# EAGLE design dac8 (EAGLE 6.5.0)
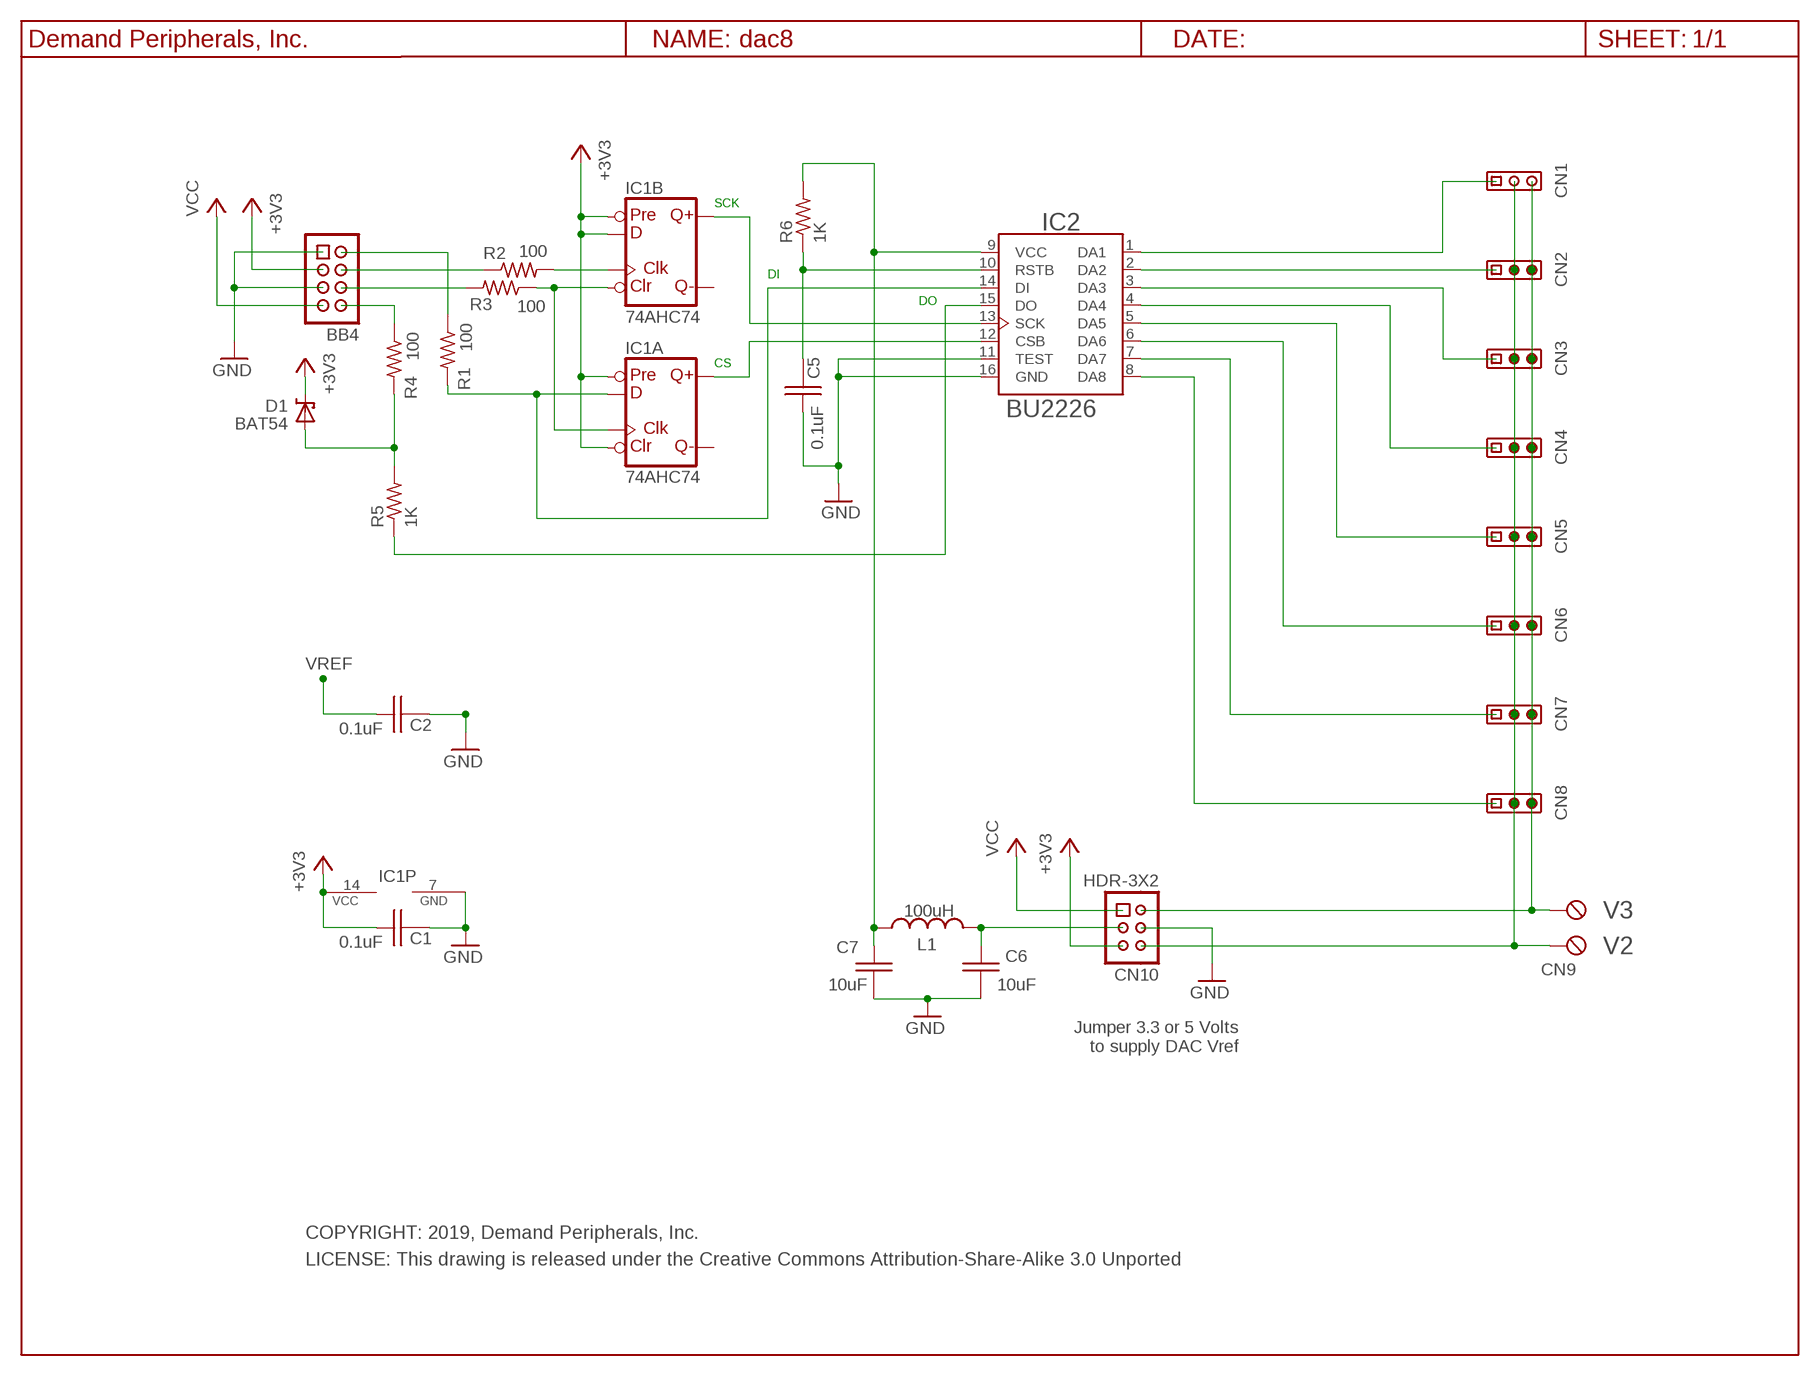
[diagram p0: schematic, sheet 1]

## Parts
BB4  BB4  HDR-4X2-SHR  [HDR-4X2]
C1  0.1uF  C0.1UF_C0603  [C0603]
C2  0.1uF  C0.1UF_C0603  [C0603]
C5  0.1uF  C0.1UF_C0603  [C0603]
C6  10uF  C10UF35V_C0805  [C0805]
C7  10uF  C10UF35V_C0805  [C0805]
CN1  HDR-3X1  [HDR-3X1]
CN2  HDR-3X1  [HDR-3X1]
CN3  HDR-3X1  [HDR-3X1]
CN4  HDR-3X1  [HDR-3X1]
CN5  HDR-3X1  [HDR-3X1]
CN6  HDR-3X1  [HDR-3X1]
CN7  HDR-3X1  [HDR-3X1]
CN8  HDR-3X1  [HDR-3X1]
CN9  TBLK-5.08-X2  [TBLK-5.08-X2]
CN10  HDR-3X2  [HDR-3X2]
D1  BAT54  [SOT23]
IC1  74AHC74  74AHC74SS  [SO14]
IC2  BU2226  [SO16]
L1  100uH  L_100UH_0805  [L0805]
R1  100  R100_R0603  [R0603]
R2  100  R100_R0603  [R0603]
R3  100  R100_R0603  [R0603]
R4  100  R100_R0603  [R0603]
R5  1K  R1K_R0603  [R0603]
R6  1K  R1K_R0603  [R0603]
S1  DP_FRAME_L  [L_FRAME]

## Nets
+3V3: BB4.3 C1.1 CN10.5 D1.3(CC) IC1.1(A:CLR) IC1.4(A:PRE) IC1.10(B:PRE) IC1.12(B:D) IC1.14(P:VCC)
GND: BB4.1 BB4.5 C1.2 C2.2 C5.1 C6.2 C7.2 CN10.4 IC1.7(P:GND) IC2.11(TEST) IC2.16(GND)
N$1: IC1.5(A:Q) IC2.12(CSB)
N$2: IC1.9(B:Q) IC2.13(SCK)
N$3: CN1.1 IC2.1(DA1)
N$4: C5.2 IC2.10(RSTB) R6.1
N$5: C6.1 CN10.3 L1.2
N$6: CN2.1 IC2.2(DA2)
N$7: CN3.1 IC2.3(DA3)
N$9: CN4.1 IC2.4(DA4)
N$10: CN5.1 IC2.5(DA5)
N$11: CN6.1 IC2.6(DA6)
N$12: CN7.1 IC2.7(DA7)
N$13: IC1.3(A:CLK) IC1.13(B:CLR) R3.1
N$14: BB4.4 R2.1
N$15: IC1.2(A:D) IC2.14(DI) R1.2
N$16: IC1.11(B:CLK) R2.2
N$17: CN8.1 IC2.8(DA8)
N$18: D1.1(A) R4.2 R5.2
N$19: BB4.6 R3.2
N$20: BB4.2 R1.1
N$21: BB4.8 R4.1
N$22: IC2.15(DO) R5.1
V2: CN1.2 CN2.2 CN3.2 CN4.2 CN5.2 CN6.2 CN7.2 CN8.2 CN9.1(KL) CN10.6
V3: CN1.3 CN2.3 CN3.3 CN4.3 CN5.3 CN6.3 CN7.3 CN8.3 CN9.2(KL1) CN10.2
VCC: BB4.7 CN10.1
VREF: C2.1 C7.1 IC2.9(VCC) L1.1 R6.2
Unconnected: IC1.6(A:!Q) IC1.8(B:!Q)

## Notes on the sheet
- SCK
- DI
- DO
- CS
- V3
- V2
- Jumper 3.3 or 5 Volts
  to supply DAC Vref
- COPYRIGHT: 2019, Demand Peripherals, Inc.
- LICENSE: This drawing is released under the Creative Commons Attribution-Share-Alike 3.0 Unported

## Library data of the parts
BB4 = dpi-conn:HDR-4X2-SHR: Shrouded 4x2 pin header; VENDOR: Digikey; VENDOR-PART-NUM: 609-3530-ND
C1 C2 C5 = dpi-passive:C0.1UF_: 0.1 uF Capacitor, 25V, X7R; VENDOR: Digikey; VENDOR-PART-NUM: 1276-1126-2-ND
C6 C7 = dpi-passive:C10UF35V_: 10 uF Capacitor, 35V, X6S; VENDOR: Digikey; VENDOR-PART-NUM: 490-10504-2-ND
CN1-CN8 = dpi-conn:HDR-3X1: 3 pin header on 0.1 inch centers, no shroud, no lock; VENDOR: Digikey; VENDOR-PART-NUM: 952-2264-ND
CN9 = dpi-conn:TBLK-5.08-X2: Terminal Block, 5.08mm, x2, screw terminals; VENDOR: Digikey; VENDOR-PART-NUM: ED2609-ND
CN10 = dpi-conn:HDR-3X2: Unshrouded 3x2 header with 0.1 inch pitch; VENDOR: Digikey; VENDOR-PART-NUM: 952-2120-ND
D1 = dpi-diopto:BAT54: Schottky Diode; VENDOR: Digikey; VENDOR-PART-NUM: DB3Y313KELCT-ND
IC1 = dpi-transic:74AHC74: Dual D type positive edge triggered FLIP FLOP, preset and clear; VENDOR: Digikey; VENDOR-PART-NUM: 568-4458-1-ND
IC2 = dpi-transic:BU2226: Rohm octal 8-bit DAC
L1 = dpi-passive:L_100UH_0805: Inductor, 100uH, 140ma; VENDOR: Digikey; VENDOR-PART-NUM: 445-9496-1-ND
R1-R4 = dpi-passive:R100_: 100 Ohm resistor, 1%, 0.1 watt; VENDOR: Digikey; VENDOR-PART-NUM: 311-100HRTR-ND
R5 R6 = dpi-passive:R1K_: 1K Resistor, 1%, 0.1 watt; VENDOR: Digikey; VENDOR-PART-NUM: 311-1.00KHRTR-ND
S1 = dpi-sym:DP_FRAME_L: Landscape Document Frame

## Board
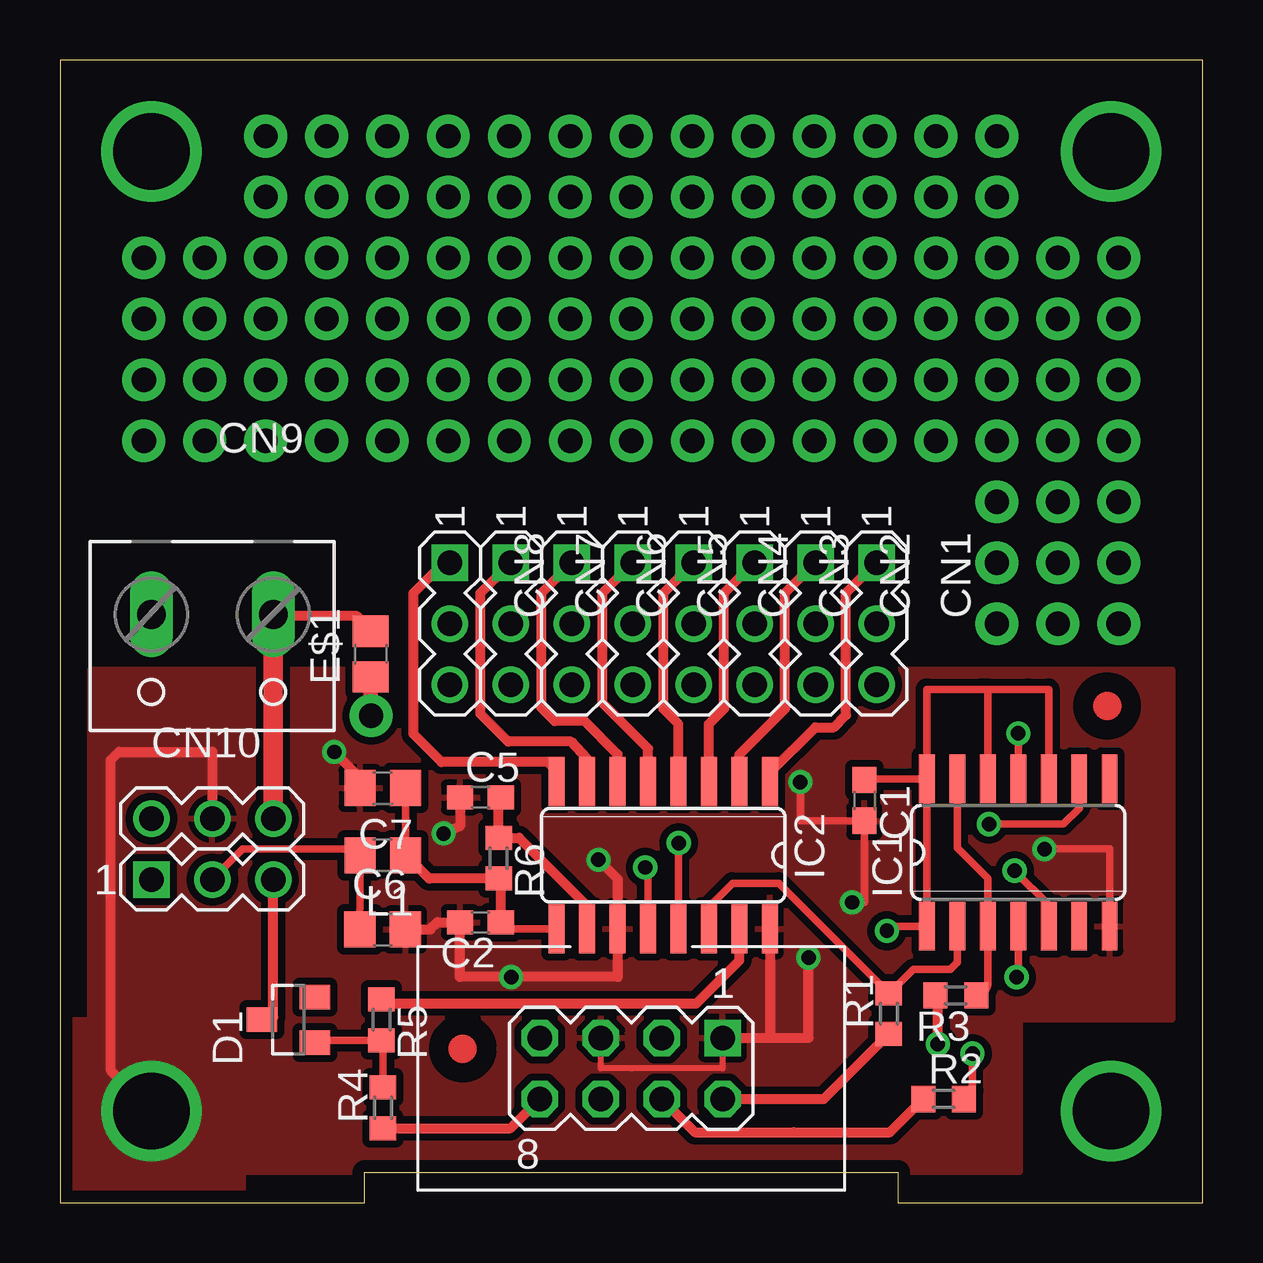
[diagram p1: board, top side]
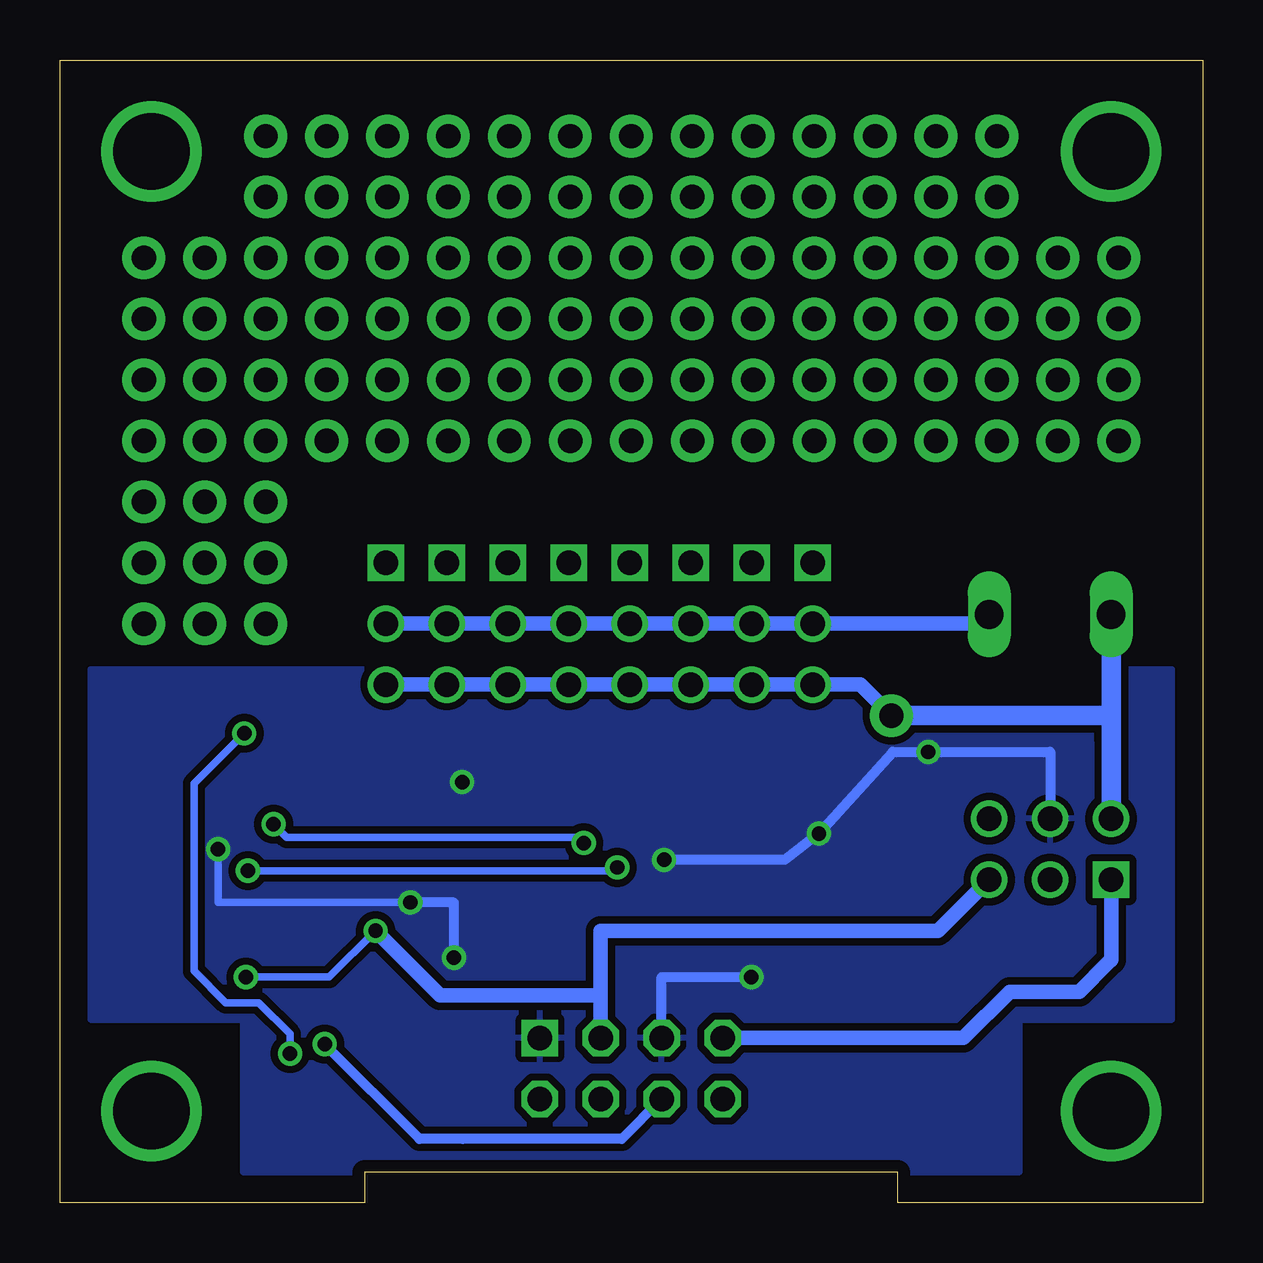
[diagram p2: board, bottom side, seen from below]

Size 47.62 x 47.62 mm. Coordinates in mm from the lower left corner, seen from the top.
Outline: 0,0 12.7,0 12.7,1.27 34.92,1.27 34.92,0 47.62,0 47.62,47.62 0,47.62 0,0
Copper layers (1*16): Top 0.035mm / dielectric 1.5mm / Bottom 0.035mm
Design rules "default *": minimum track width 10mil, minimum drill 18mil, track to track 12mil, track to pad 12mil, pad to pad 12mil, via to via 12mil, smd to smd 10mil, copper to edge 20mil, drill to drill 12mil, minimum pad ring 10mil, minimum via ring 8mil, stop-mask expansion 4mil, vias tented up to drill 30mil, thermal gap 10mil
tKeepout: area 15.1,1 to 32.5,9.7

### Footprints (pad centres in the part's own frame; a part is rotated, then mirrored left to right if it is on the bottom)
HDR-4X2 = drill 1.016 square: 1 -3.81,-1.27 | drill 1.016 octagon: 2 -3.81,1.27; 3 -1.27,-1.27; 4 -1.27,1.27; 5 1.27,-1.27; 6 1.27,1.27; 7 3.81,-1.27; 8 3.81,1.27
C0603 = smd 1.1 x 1: 1 -0.85,0; 2 0.85,0
C0805 = smd 1.3 x 1.5: 1 -0.95,0; 2 0.95,0
HDR-3X1 = drill 1.016 square: 1 -2.54,0 | drill 1.016: 2 0,0; 3 2.54,0
TBLK-5.08-X2 = drill 1.194 long: 1 -2.54,-0.127; 2 2.54,-0.127
HDR-3X2 = drill 1.016 square: 1 -2.54,-1.27 | drill 1.016: 2 -2.54,1.27; 3 0,-1.27; 4 0,1.27; 5 2.54,-1.27; 6 2.54,1.27
SOT23 = smd 1.016 x 1.27: 1 -0.95,-1.1; 2 0.95,-1.1; 3 0,1.1
SO14 = smd 0.66 x 2.032: 1 -3.81,-3.073; 2 -2.54,-3.073; 3 -1.27,-3.073; 4 0,-3.073; 5 1.27,-3.073; 6 2.54,-3.073; 7 3.81,-3.073; 8 3.81,3.073; 9 2.54,3.073; 10 1.27,3.073; 11 0,3.073; 12 -1.27,3.073; 13 -2.54,3.073; 14 -3.81,3.073
SO16 = smd 0.66 x 2.032: 1 -4.445,-3.073; 2 -3.175,-3.073; 3 -1.905,-3.073; 4 -0.635,-3.073; 5 0.635,-3.073; 6 1.905,-3.073; 7 3.175,-3.073; 8 4.445,-3.073; 9 4.445,3.073; 10 3.175,3.073; 11 1.905,3.073; 12 0.635,3.073; 13 -0.635,3.073; 14 -1.905,3.073; 15 -3.175,3.073; 16 -4.445,3.073
L0805 = smd 1.3 x 1.5: 1 -0.95,0; 2 0.95,0
R0603 = smd 1 x 1.1: 1 -0.85,0; 2 0.85,0

### Placement (x,y rotation side)
BB4  23.81,5.59 180 top
C1  33.53,16.76 270 top
C2  17.53,11.68 180 top
C5  17.53,16.89 0 top
C6  13.45,11.38 0 top
C7  13.46,17.27 180 top
CN1  34.04,24.13 270 top
CN2  31.5,24.13 270 top
CN3  28.96,24.13 270 top
CN4  26.42,24.13 270 top
CN5  23.88,24.13 270 top
CN6  21.34,24.13 270 top
CN7  18.8,24.13 270 top
CN8  16.26,24.13 270 top
CN9  6.35,24.38 180 top
CN10  6.35,14.73 0 top
D1  9.53,7.62 90 top
E$1  [C0805]  12.95,22.86 90 top
IC1  39.94,14.59 0 top
IC2  25.15,14.48 180 top
L1  13.46,14.48 180 top
R1  34.54,7.87 90 top
R2  36.83,4.32 0 top
R3  37.34,8.64 180 top
R4  13.46,3.95 90 top
R5  13.4,7.62 270 top
R6  18.29,14.35 270 top
S1  -0.76,-0.76 0 top
U$2  [DPI-2]  43.48,19.81 90 bottom
U$4  [FIDUCIAL]  43.65,20.7 270 top
U$6  [FIDUCIAL]  16.79,6.41 0 top

### Tracks (layer width: path | path; a pad name or v marks a point on that pad's centre or on a via)
+3V3  (via drill 0.6)
  Top 0.305: D1.3 8.89,7.73 | C1.1 33.58,17.67 IC1.14 | IC1.14 36.13,21.39 38.38,21.39 | 38.38,21.39 40.34,21.39 41.21,21.39 IC1.10 | IC1.12 38.67,21.39 38.38,21.39 | IC1.14 IC1.1 34.66,11.52 v34.47,11.33 | IC1.4 39.94,9.46 v39.88,9.4
  Top 0.406: 8.89,7.73 CN10.5
  Bottom 0.305: v39.88,9.4 37.82,9.4 36.4,9.4 v34.47,11.33
  Bottom 0.61: CN10.5 11.02,11.33 25.09,11.33 25.09,8.59 | v34.47,11.33 31.77,8.64 25.09,8.64 25.09,8.59 | BB4.3 25.09,6.86 25.09,8.59
GND  (via drill 0.6, 3.17)
  Top 0.254: BB4.1 27.62,5.59 23.81,5.59 22.54,5.59 BB4.5
  Top 0.305: IC1.7 43.75,14.73 v41.03,14.73 | v33.02,12.51 33.53,12.51 C1.2 30.86,15.91 v30.86,17.53
  Top 0.406: C7.2 12.51,17.7 v11.43,18.78 | BB4.1 29.98,6.86 | 29.98,6.86 31.2,6.86 v31.2,10.21 | IC2.16 29.59,6.86 29.98,6.86 | C6.2 15.43,11.38 15.73,11.68 C2.2 16.68,9.4 v18.81,9.4 23.24,9.4 IC2.11 23.24,13.49 v22.44,14.29 | C5.1 16.68,15.69 v15.99,15.38 | v3.81,3.81 2.12,5.5 2.12,18.45 2.45,18.78 6.35,18.78 CN10.4
  Bottom 0.305: v41.03,14.73 41.03,12.51 v33.02,12.51
  Bottom 0.406: CN10.4 6.35,18.78 v11.43,18.78 12.92,18.78 v15.99,15.38 17.41,14.29 v22.44,14.29 | v31.2,10.21 31.2,12.51 v33.02,12.51 | BB4.5 22.54,9.4 v18.81,9.4
  pour Top: 1.27,22.23 46.35,22.23 46.35,7.62 40.01,7.62 40.01,1.27 7.62,1.27 7.62,0.51 0.51,0.51 0.51,7.62 1.27,7.62
  pour Bottom: 1.27,22.23 46.35,22.23 46.35,7.62 40.01,7.62 40.01,1.27 7.62,1.27 7.62,7.62 1.27,7.62
MOUNT2  (via drill 3.17)
  other vias: 43.81,43.81
MOUNT3  (via drill 3.17)
  other vias: 43.81,3.81
MOUNT4  (via drill 3.17)
  other vias: 3.81,43.81
N$1  (via drill 0.6)
  Top 0.305: IC2.12 24.51,13.86 v24.4,13.97 | IC1.5 41.21,12.41 v39.79,13.83
  Bottom 0.305: v24.4,13.97 24.54,13.83 37.31,13.83 v39.79,13.83
N$2  (via drill 0.6)
  Top 0.305: IC2.13 25.78,14.97 v25.79,14.99 | IC1.9 42.48,16.43 41.82,15.77 v38.72,15.77
  Bottom 0.305: v25.79,14.99 26.04,15.23 38.18,15.23 v38.72,15.77
N$3
  Top 0.406: IC2.1 29.59,17.92 31.48,19.81 32.26,19.81 32.77,20.32 32.77,25.4 CN1.1
N$4
  Top 0.305: IC2.10 21.97,12.37
  Top 0.406: 21.97,12.37 19.14,15.2 R6.1 18.29,16.8 C5.2
N$5
  Top 0.305: C6.1 12.51,13.06 L1.2 | 12.11,14.07 L1.2 | CN10.3 7.62,14.73 11.18,14.73 12.51,14.73 L1.2
N$6
  Top 0.406: IC2.2 28.32,18.67 30.23,20.57 30.23,25.4 CN2.1
N$7
  Top 0.406: IC2.3 27.05,19.94 27.69,20.57 27.69,25.4 CN3.1
N$9
  Top 0.406: IC2.4 25.78,19.94 25.15,20.57 25.15,25.4 CN4.1
N$10
  Top 0.406: IC2.5 24.51,18.92 22.61,20.83 22.61,25.4 CN5.1
N$11
  Top 0.406: CN6.1 20.07,25.4 20.07,24.64 20.07,20.62 20.13,20.56 20.57,20.12 20.62,20.07 21.86,20.07 23.24,18.68 IC2.6
N$12
  Top 0.406: IC2.7 21.97,18.49 21.3,19.21 18.68,19.21 17.53,20.37 17.53,25.4 CN7.1
N$13
  Top 0.305: R3.1 arc90 38.67,9.12 IC1.3 38.67,13.51 37.59,14.59 37.4,14.78 IC1.13
N$14
  Top 0.406: BB4.4 26.47,2.93 30.58,2.93 34.6,2.93 R2.1
N$15
  Top 0.305: IC1.2 37.4,10.01 37.31,9.92 37.11,9.72 35.57,9.72 34.58,8.72 R1.2 29.96,13.31 28.03,13.31 27.05,12.33 IC2.14
N$16  (via drill 0.6)
  Top 0.305: R2.2 38.04,4.67 v38.04,6.21 | v39.94,19.56 IC1.11
  Bottom 0.305: v38.04,6.21 38.04,7.02 39.34,8.33 40.72,8.33 42.04,9.65 42.04,14.71 42.04,17.46 v39.94,19.56
N$17
  Top 0.406: IC2.8 20.7,17.97 20.34,18.36 15.9,18.36 14.73,19.53 14.73,25.4 16,26.67 CN8.1
N$18
  Top 0.305: D1.1 11.08,6.77 R5.2 13.46,6.71 R4.2
N$19  (via drill 0.6)
  Top 0.406: v36.59,6.6 36.59,8.54 R3.2
  Bottom 0.406: BB4.6 24.21,2.65 30.84,2.65 32.64,2.65 v36.59,6.6
N$20
  Top 0.406: BB4.2 31.84,4.32 R1.1
N$21
  Top 0.406: R4.1 18.78,3.1 BB4.8
N$22
  Top 0.406: R5.1 13.4,8.29 26.53,8.29 28.32,10.08 IC2.15
N$24
  Top 0.61: 13.02,20.14 12.95,20.21 12.95,21.83
N$25
  Top 0.406: 12.95,23.88 12.38,24.45 8.91,24.45
V2
  Top 0.813: CN10.6 CN9.1
  Bottom 0.61: CN1.2 CN2.2 CN3.2 CN4.2 CN5.2 CN6.2 CN7.2 CN8.2 15.18,24.13 14.2,24.13 8.89,24.13 CN9.1
V3  (via drill 1.02 pad 1.78)
  Bottom 0.61: CN1.3 CN2.3 CN3.3 CN4.3 CN5.3 CN6.3 CN7.3 CN8.3 14.92,21.59 14.26,21.59 v12.97,20.3
  Bottom 0.813: CN9.2 3.81,20.3 | 3.81,20.3 3.81,19.33 | 3.81,19.33 CN10.2 | v12.97,20.3 3.81,20.3 | 3.81,20.3 3.81,19.33
VCC
  Bottom 0.61: BB4.7 13.72,6.86 9.97,6.86 8.04,8.79 5.14,8.79 3.92,10.01 3.81,10.12 CN10.1
VREF
  Top 0.305: C7.1 L1.1 | IC2.9 18.62,11.4 C2.1
  Top 0.406: C2.1 18.38,13.41 R6.2 15.39,13.5 L1.1
WW1  (via drill 1.02 pad 1.78)
  other vias: 3.49,31.75
WW2  (via drill 1.02 pad 1.78)
  other vias: 6.03,31.75
WW3  (via drill 1.02 pad 1.78)
  other vias: 8.57,31.75
WW4  (via drill 1.02 pad 1.78)
  other vias: 11.11,31.75
WW5  (via drill 1.02 pad 1.78)
  other vias: 13.65,31.75
WW6  (via drill 1.02 pad 1.78)
  other vias: 3.49,34.29
WW7  (via drill 1.02 pad 1.78)
  other vias: 3.49,36.83
WW8  (via drill 1.02 pad 1.78)
  other vias: 3.49,39.37
WW9  (via drill 1.02 pad 1.78)
  other vias: 16.19,31.75
WW10  (via drill 1.02 pad 1.78)
  other vias: 18.73,31.75
WW11  (via drill 1.02 pad 1.78)
  other vias: 39.05,29.21
WW12  (via drill 1.02 pad 1.78)
  other vias: 21.27,31.75
WW13  (via drill 1.02 pad 1.78)
  other vias: 23.81,31.75
WW14  (via drill 1.02 pad 1.78)
  other vias: 26.35,31.75
WW15  (via drill 1.02 pad 1.78)
  other vias: 28.89,31.75
WW16  (via drill 1.02 pad 1.78)
  other vias: 31.43,31.75
WW17  (via drill 1.02 pad 1.78)
  other vias: 6.03,34.29
WW18  (via drill 1.02 pad 1.78)
  other vias: 6.03,36.83
WW19  (via drill 1.02 pad 1.78)
  other vias: 6.03,39.37
WW20  (via drill 1.02 pad 1.78)
  other vias: 41.59,26.67
WW21  (via drill 1.02 pad 1.78)
  other vias: 41.59,29.21
WW22  (via drill 1.02 pad 1.78)
  other vias: 33.97,31.75
WW25  (via drill 1.02 pad 1.78)
  other vias: 39.05,26.67
WW28  (via drill 1.02 pad 1.78)
  other vias: 8.57,34.29
WW29  (via drill 1.02 pad 1.78)
  other vias: 8.57,36.83
WW30  (via drill 1.02 pad 1.78)
  other vias: 8.57,39.37
WW31  (via drill 1.02 pad 1.78)
  other vias: 8.57,41.91
WW32  (via drill 1.02 pad 1.78)
  other vias: 8.57,44.45
WW33  (via drill 1.02 pad 1.78)
  other vias: 44.13,26.67
WW34  (via drill 1.02 pad 1.78)
  other vias: 44.13,29.21
WW39  (via drill 1.02 pad 1.78)
  other vias: 11.11,34.29
WW40  (via drill 1.02 pad 1.78)
  other vias: 11.11,36.83
WW41  (via drill 1.02 pad 1.78)
  other vias: 11.11,39.37
WW42  (via drill 1.02 pad 1.78)
  other vias: 11.11,41.91
WW43  (via drill 1.02 pad 1.78)
  other vias: 11.11,44.45
WW47  (via drill 1.02 pad 1.78)
  other vias: 39.05,24.13
WW50  (via drill 1.02 pad 1.78)
  other vias: 13.65,34.29
WW51  (via drill 1.02 pad 1.78)
  other vias: 13.65,36.83
WW52  (via drill 1.02 pad 1.78)
  other vias: 13.65,39.37
WW53  (via drill 1.02 pad 1.78)
  other vias: 13.65,41.91
WW54  (via drill 1.02 pad 1.78)
  other vias: 13.65,44.45
WW61  (via drill 1.02 pad 1.78)
  other vias: 16.19,34.29
WW62  (via drill 1.02 pad 1.78)
  other vias: 16.19,36.83
WW63  (via drill 1.02 pad 1.78)
  other vias: 16.19,39.37
WW64  (via drill 1.02 pad 1.78)
  other vias: 16.19,41.91
WW65  (via drill 1.02 pad 1.78)
  other vias: 16.19,44.45
WW72  (via drill 1.02 pad 1.78)
  other vias: 18.73,34.29
WW73  (via drill 1.02 pad 1.78)
  other vias: 18.73,36.83
WW74  (via drill 1.02 pad 1.78)
  other vias: 18.73,39.37
WW75  (via drill 1.02 pad 1.78)
  other vias: 18.73,41.91
WW76  (via drill 1.02 pad 1.78)
  other vias: 18.73,44.45
WW79  (via drill 1.02 pad 1.78)
  other vias: 44.13,24.13
WW83  (via drill 1.02 pad 1.78)
  other vias: 21.27,34.29
WW84  (via drill 1.02 pad 1.78)
  other vias: 21.27,36.83
WW85  (via drill 1.02 pad 1.78)
  other vias: 21.27,39.37
WW86  (via drill 1.02 pad 1.78)
  other vias: 21.27,41.91
WW87  (via drill 1.02 pad 1.78)
  other vias: 21.27,44.45
WW94  (via drill 1.02 pad 1.78)
  other vias: 23.81,34.29
WW95  (via drill 1.02 pad 1.78)
  other vias: 23.81,36.83
WW96  (via drill 1.02 pad 1.78)
  other vias: 23.81,39.37
WW97  (via drill 1.02 pad 1.78)
  other vias: 23.81,41.91
WW98  (via drill 1.02 pad 1.78)
  other vias: 23.81,44.45
WW105  (via drill 1.02 pad 1.78)
  other vias: 26.35,34.29
WW106  (via drill 1.02 pad 1.78)
  other vias: 26.35,36.83
WW107  (via drill 1.02 pad 1.78)
  other vias: 26.35,39.37
WW108  (via drill 1.02 pad 1.78)
  other vias: 26.35,41.91
WW109  (via drill 1.02 pad 1.78)
  other vias: 26.35,44.45
WW110  (via drill 1.02 pad 1.78)
  other vias: 41.59,24.13
WW116  (via drill 1.02 pad 1.78)
  other vias: 28.89,34.29
WW117  (via drill 1.02 pad 1.78)
  other vias: 28.89,36.83
WW118  (via drill 1.02 pad 1.78)
  other vias: 28.89,39.37
WW119  (via drill 1.02 pad 1.78)
  other vias: 28.89,41.91
WW120  (via drill 1.02 pad 1.78)
  other vias: 28.89,44.45
WW127  (via drill 1.02 pad 1.78)
  other vias: 31.43,34.29
WW128  (via drill 1.02 pad 1.78)
  other vias: 31.43,36.83
WW129  (via drill 1.02 pad 1.78)
  other vias: 31.43,39.37
WW130  (via drill 1.02 pad 1.78)
  other vias: 31.43,41.91
WW131  (via drill 1.02 pad 1.78)
  other vias: 31.43,44.45
WW138  (via drill 1.02 pad 1.78)
  other vias: 33.97,34.29
WW139  (via drill 1.02 pad 1.78)
  other vias: 33.97,36.83
WW140  (via drill 1.02 pad 1.78)
  other vias: 33.97,39.37
WW141  (via drill 1.02 pad 1.78)
  other vias: 33.97,41.91
WW142  (via drill 1.02 pad 1.78)
  other vias: 33.97,44.45
WW148  (via drill 1.02 pad 1.78)
  other vias: 36.51,31.75
WW149  (via drill 1.02 pad 1.78)
  other vias: 36.51,34.29
WW150  (via drill 1.02 pad 1.78)
  other vias: 36.51,36.83
WW151  (via drill 1.02 pad 1.78)
  other vias: 36.51,39.37
WW152  (via drill 1.02 pad 1.78)
  other vias: 36.51,41.91
WW153  (via drill 1.02 pad 1.78)
  other vias: 36.51,44.45
WW159  (via drill 1.02 pad 1.78)
  other vias: 39.05,31.75
WW160  (via drill 1.02 pad 1.78)
  other vias: 39.05,34.29
WW161  (via drill 1.02 pad 1.78)
  other vias: 39.05,36.83
WW162  (via drill 1.02 pad 1.78)
  other vias: 39.05,39.37
WW163  (via drill 1.02 pad 1.78)
  other vias: 39.05,41.91
WW164  (via drill 1.02 pad 1.78)
  other vias: 39.05,44.45
WW170  (via drill 1.02 pad 1.78)
  other vias: 41.59,31.75
WW171  (via drill 1.02 pad 1.78)
  other vias: 41.59,34.29
WW172  (via drill 1.02 pad 1.78)
  other vias: 41.59,36.83
WW173  (via drill 1.02 pad 1.78)
  other vias: 41.59,39.37
WW181  (via drill 1.02 pad 1.78)
  other vias: 44.13,31.75
WW182  (via drill 1.02 pad 1.78)
  other vias: 44.13,34.29
WW183  (via drill 1.02 pad 1.78)
  other vias: 44.13,36.83
WW184  (via drill 1.02 pad 1.78)
  other vias: 44.13,39.37

### Text on the board
tTest: 1.875 Inches | 1.575 Inches | DAC8, Rev 19B | V3 | V2 | 8 | 7 | 6 | 5 | 4 | 3 | 2 | 1 | V2 | V3 | V3 | GND | V2 | C7 | C5 | IC2 | C1 | IC1 | 1.575 Inches | 1.875 Inches | L1 | R6 | C2 | 5.0 | 3.3 | C6 | R1 | Vref | R5 | R3 | D1 | (C) 2019, Demand Peripherals, Inc. | R4 | R2 | BB4